# EAGLE design LB_BIT_i19_ROLLERSWITCH-v02(rev1) (EAGLE 6.6.0)
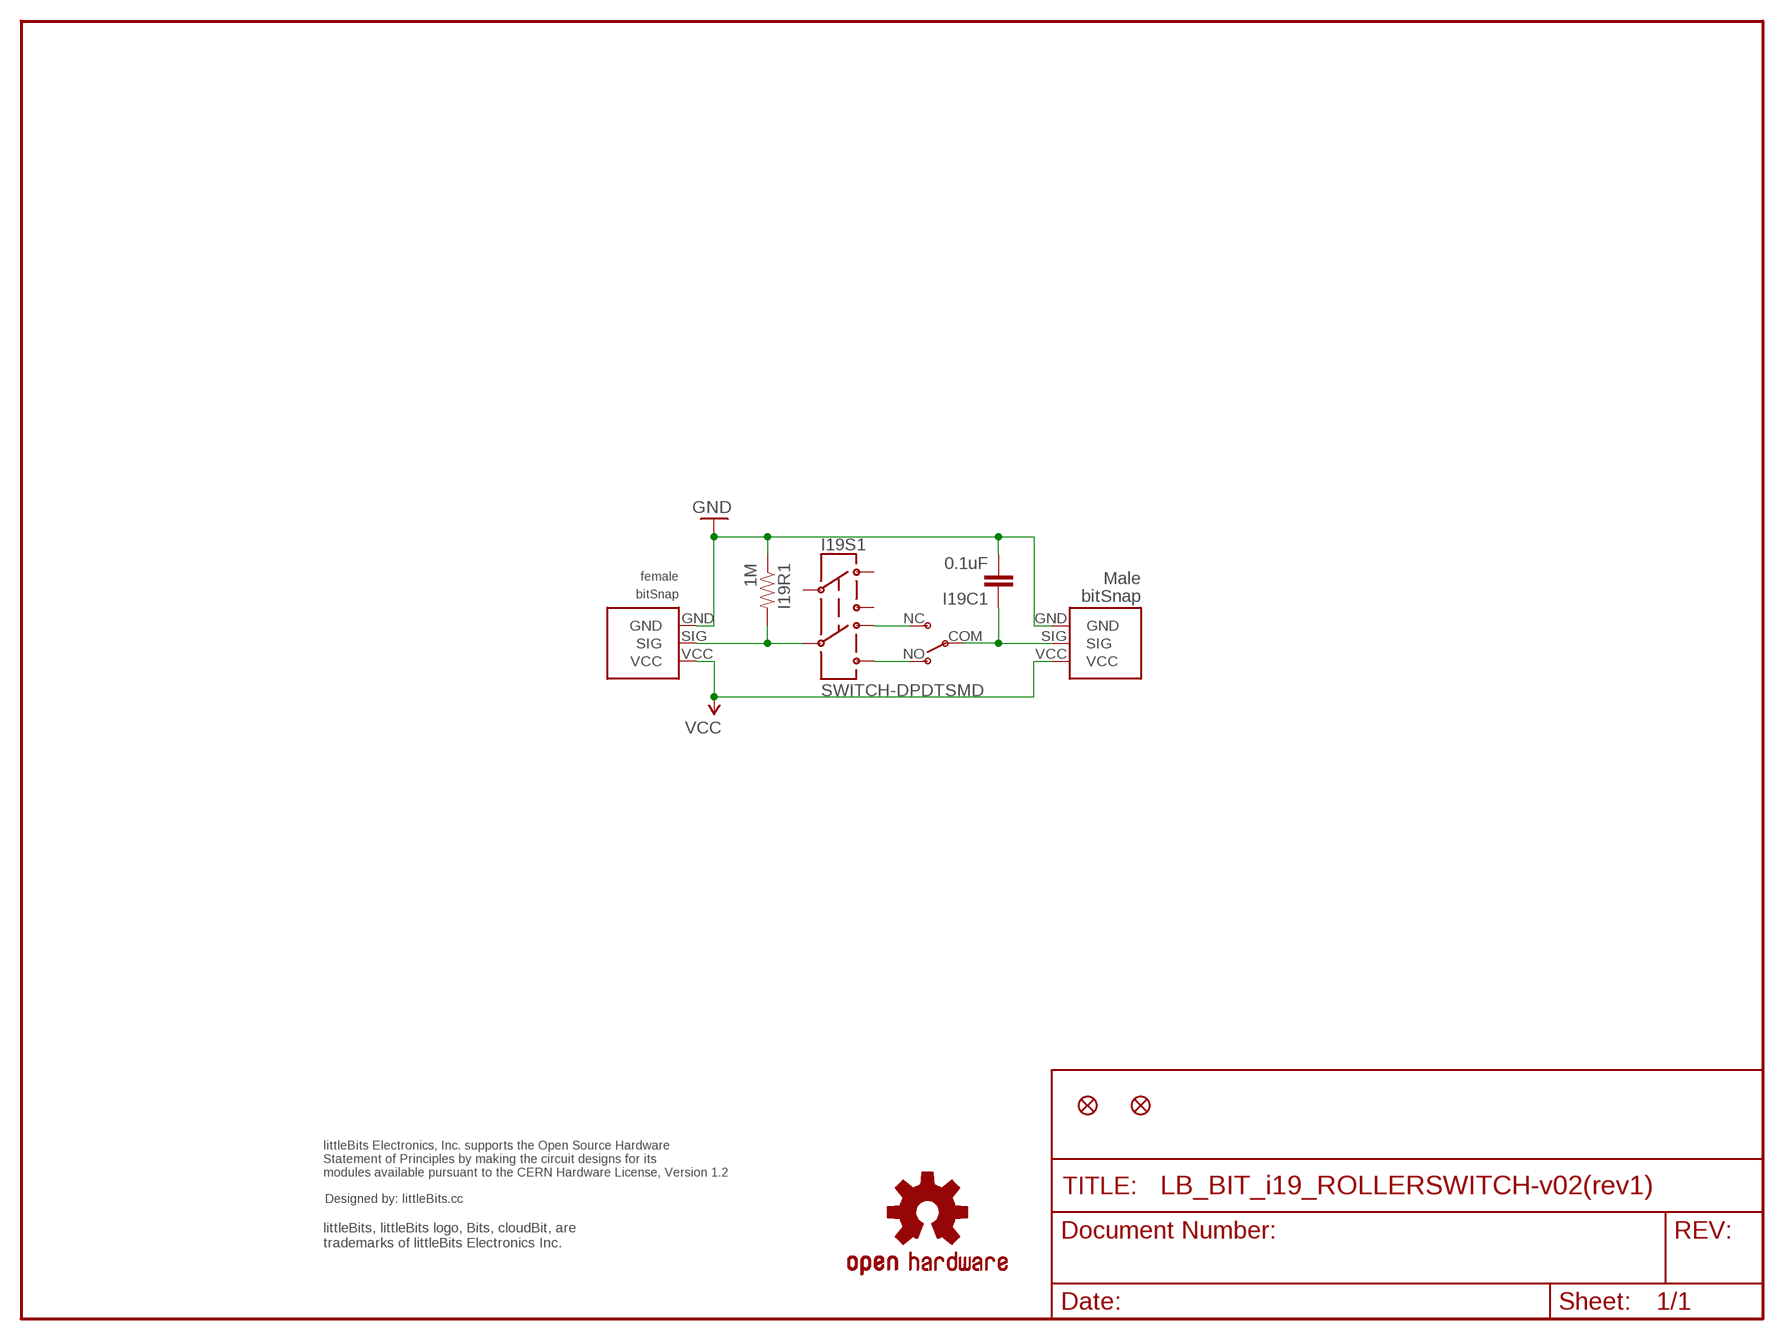
[diagram p0: schematic, sheet 1]

## Parts
I3BSF  BITSNAP_FEMALE  [BITSNAP_FEMALE]
I3BSM  BITSNAP_MALE  [BITSNAP_MALE]
I19C1  0.1uF  CAP0603-CAP  [0603-CAP]
I19FD1  FIDUCIAL1X2  [FIDUCIAL-1X2]
I19FD2  FIDUCIAL1X2  [FIDUCIAL-1X2]
I19R1  1M  RESISTOR0603-RES  [0603-RES]
I19S1  SWITCH-DPDTSMD  [AYZ0202]
I19SW2  ROLLERSWITCH-OMRON-SS-5GL2DRIGHTANGLE  [ROLLERSWITCH-OMRON-D2F-01FL-A]
U$1  OSHWCREDIT  [OSHWCREDIT]
U$3  OSHW-LOGOL  [OSHW-LOGO-L]

## Nets
GND: I3BSF.GND I3BSM.GND I19C1.2 I19R1.1
N$1: I19S1.4 I19SW2.NC
N$2: I19S1.6 I19SW2.NO
SIG: I3BSF.SIG I19R1.2 I19S1.5
SIG2: I3BSM.SIG I19C1.1 I19SW2.COM
VCC: I3BSF.VCC I3BSM.VCC
Unconnected: I19S1.1 I19S1.2 I19S1.3

## Library data of the parts
I3BSF = bitSnap:BITSNAP_FEMALE
I3BSM = bitSnap:BITSNAP_MALE
I19C1 = SparkFun:CAP: Capacitor Standard 0603 ceramic capacitor, and 0.1" leaded capacitor.
I19FD1 I19FD2 = SparkFun:FIDUCIAL: Fiducial Alignment Points Various fiducial points for machine vision alignment.
I19R1 = SparkFun:RESISTOR: Resistor Basic schematic elements and footprints for 0603, 1206, and PTH 1/10th watt (small) resistors.
I19S1 = SparkFun:SWITCH-DPDT: DPDT Version of the COM-00597
I19SW2 = LITTLEBITS:ROLLERSWITCH-OMRON-SS-5GL2D
U$1 = LITTLEBITS:OSHWCREDIT
U$3 = SparkFun_NEW:OSHW-LOGO: Open Source Hardware Logo This logo indicates the piece of hardware it is found on incorporates a OSHW license and/or adheres to the definition of open source hardware found here: http://freedomdefined.org/OSHW

## Board
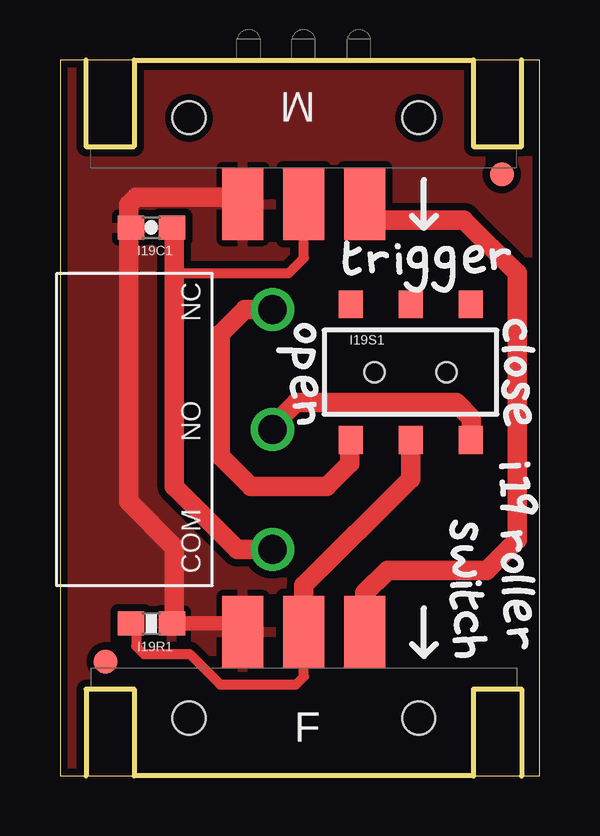
[diagram p1: board, top side]
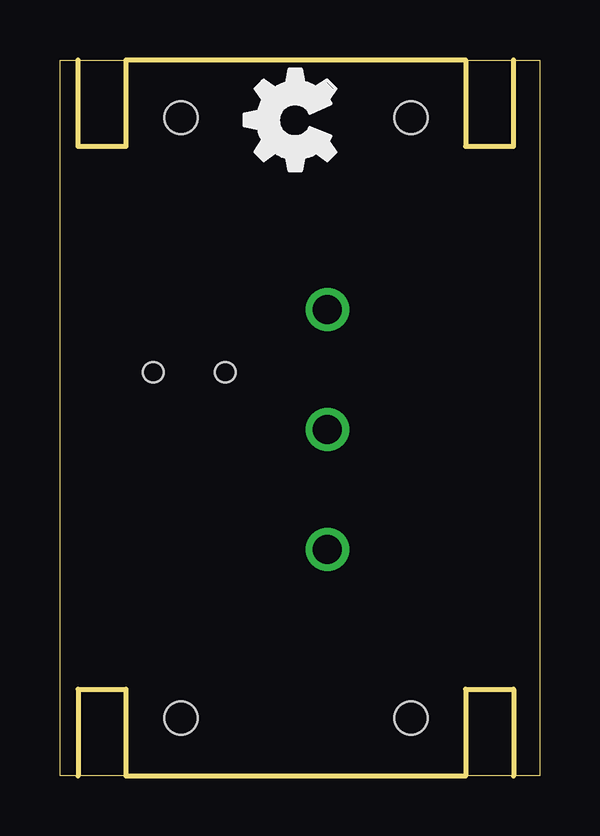
[diagram p2: board, bottom side, seen from below]

Size 19.99 x 29.84 mm. Coordinates in mm from the lower left corner, seen from the top.
Outline: 0,0 19.99,0 19.99,29.84 0,29.84 0,0
Copper layers (1*16): Top 0.035mm / dielectric 1.5mm / Bottom 0.035mm
Design rules "default": minimum track width 8mil, minimum drill 20mil, track to track 8mil, track to pad 8mil, pad to pad 8mil, via to via 8mil, smd to smd 8mil, copper to edge 10mil, drill to drill 8mil, minimum pad ring 12mil, minimum via ring 10mil, stop-mask expansion 4mil, vias tented up to drill 25mil, thermal gap 10mil

### Footprints (pad centres in the part's own frame; a part is rotated, then mirrored left to right if it is on the bottom)
BITSNAP_FEMALE = smd 1.7 x 3: GND 6.35,6; SIG 8.89,6; VCC 11.43,6 | hole 1.37: 13.68,2.41; 4.1,2.41
BITSNAP_MALE = smd 1.7 x 3: GND 11.43,6; SIG 8.89,6; VCC 6.35,6 | hole 1.37: 13.68,2.41; 4.1,2.41
0603-CAP = smd 1.1 x 1: 1 -0.85,0; 2 0.85,0
FIDUCIAL-1X2 = smd 1 x 1: 1 0,0
0603-RES = smd 1.1 x 1: 1 -0.85,0; 2 0.85,0
AYZ0202 = smd 1 x 1.15: 1 -2.5,2.825; 2 0,2.825; 3 2.5,2.825; 4 -2.5,-2.825; 5 0,-2.825; 6 2.5,-2.825 | hole 0.85: 1.5,0; -1.5,0
ROLLERSWITCH-OMRON-D2F-01FL-A = drill 1.2: COM 1.5,-2.5; NC 11.5,-2.5; NO 6.5,-2.5

### Placement (x,y rotation side)
I3BSF  1.27,0 0 top
I3BSM  19.05,29.84 180 top
I19C1  3.81,22.86 180 top
I19FD1  18.41,25.08 0 top
I19FD2  1.91,4.76 0 top
I19R1  3.81,6.35 180 top
I19S1  14.61,16.83 0 top
I19SW2  6.35,7.94 90 top
U$1  -17.78,-24.13 0 top  (outside the outline)
U$3  -13.97,-11.43 0 top  (outside the outline)
U$20  [OSHW_FILLX150_NOTEXT]  8.51,24.38 0 top
U$36  [T]  11.62,20.76 0 top
U$37  [R]  12.57,20.76 0 top
U$38  [I]  13.84,20.76 0 top
U$39  [G]  14.16,20.13 0 top
U$40  [G]  15.3,20.13 0 top
U$41  [E]  16.57,20.76 0 top
U$42  [R]  17.65,20.89 0 top
U$43  [I]  18.16,13.21 270 top
U$44  [1]  18.29,12.57 270 top
U$45  [9]  18.29,11.81 270 top
U$46  [R]  18.16,10.48 270 top
U$47  [O]  18.29,9.46 270 top
U$48  [L]  18.29,8.45 270 top
U$49  [L]  18.29,7.94 270 top
U$50  [E]  18.29,7.56 270 top
U$51  [R]  18.41,6.41 270 top
U$52  [S]  16.13,10.79 270 top
U$53  [W]  16.26,9.78 270 top
U$54  [I]  16.13,8.26 270 top
U$55  [T]  16.13,7.87 270 top
U$56  [C]  16.26,6.99 270 top
U$57  [H]  16.13,5.84 270 top
U$58  [C]  18.29,19.18 270 top
U$59  [L]  18.29,18.03 270 top
U$60  [O]  18.41,17.65 270 top
U$61  [S]  18.29,16.64 270 top
U$62  [E]  18.29,15.75 270 top
U$63  [O]  9.65,19.05 270 top
U$64  [P]  8.76,18.03 270 top
U$65  [E]  9.4,16.89 270 top
U$66  [N]  9.65,15.62 270 top

### Tracks (layer width: path | path; a pad name or v marks a point on that pad's centre or on a via)
GND
  Top 0.406: 7.27,6.35 I3BSF.GND
  Top 0.61: I19R1.1 7.27,6.35
  Top 0.813: I19R1.1 4.76,6.65 4.76,9.53 2.86,11.43 2.86,22.76 I19C1.2 2.86,22.96 2.86,23.81 3.17,24.13 6.7,24.13 I3BSM.GND
  pour Top (isolate 0.305): 0.32,29.53 19.68,29.53 19.68,0.32 0.32,0.32
N$1
  Top 0.813: I19SW2.NC 7.69,19.44 6.67,18.41 6.67,13.34 7.94,12.06 11.11,12.06 12.06,13.02 12.06,13.96 I19S1.4
N$2
  Top 0.813: I19S1.6 17.14,14.04 17.14,14.92 16.51,15.56 9.84,15.56 9.06,14.77 9.06,14.64 I19SW2.NO
SIG
  Top 0.406: I3BSF.SIG 10.16,4.13 9.84,3.81 6.67,3.81 5.4,5.08 3.49,5.08 3.17,5.4 3.17,6.33 I19R1.2
  Top 0.813: I3BSF.SIG 10.16,7.94 14.61,12.38 I19S1.5
SIG2
  Top 0.406: I3BSM.SIG 10.16,21.59 9.53,20.95 4.76,20.95
  Top 0.813: I19SW2.COM 7.39,9.44 4.76,12.06 4.76,20.95 4.76,22.56 I19C1.1
VCC
  Top 0.813: I3BSF.VCC 12.7,7.62 13.65,8.57 17.78,8.57 19.05,9.84 19.05,20.95 16.83,23.18 12.73,23.18 I3BSM.VCC